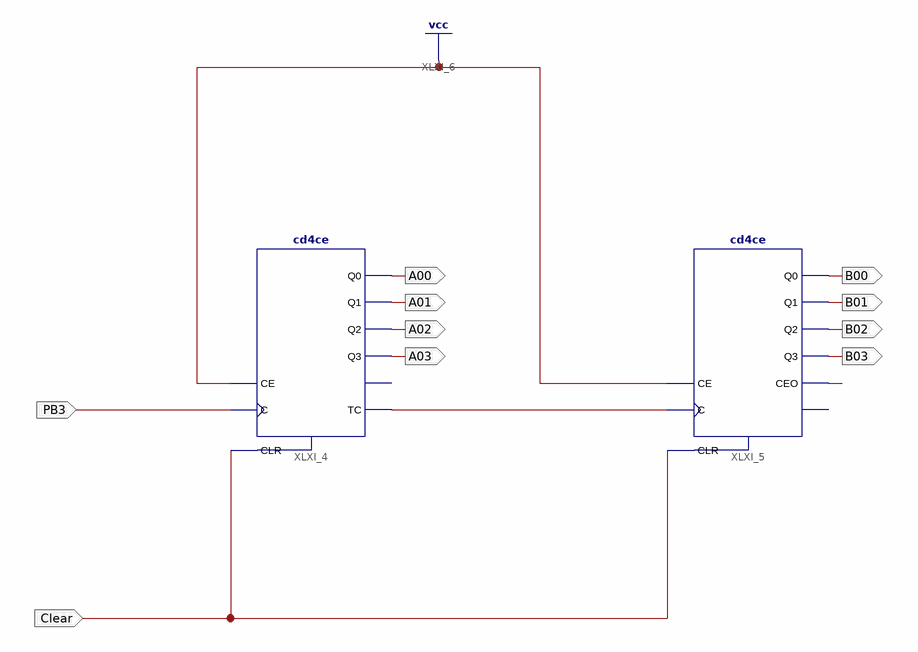
[diagram p0: schematic sheet 1]
// Xilinx ISE schematic count00_99.sch (spartan6) as structural Verilog: 2 symbols, 10 ports
module count00_99 (
  input  PB3,
  input  Clear,
  output A00,
  output A01,
  output A02,
  output A03,
  output B00,
  output B01,
  output B02,
  output B03
);

  wire XLXN_43, XLXN_44;

  cd4ce XLXI_4 (.C(PB3), .CE(1'b1), .CLR(Clear), .Q0(A00), .Q1(A01), .Q2(A02), .Q3(A03), .TC(XLXN_44));  // open: CEO
  cd4ce XLXI_5 (
    .C(XLXN_44), .CE(1'b1), .CLR(Clear), .CEO(XLXN_43), .Q0(B00), .Q1(B01), .Q2(B02), .Q3(B03));  // open: TC

  // Notes on the sheet:
  //   LOC on signal PB3 = P47
  //   CLOCK_DEDICATED_ROUTE on signal PB3 = TRUE
  //   LOC on signal Clear = P46
endmodule
